# EAGLE design probebase (EAGLE 9.6.2)
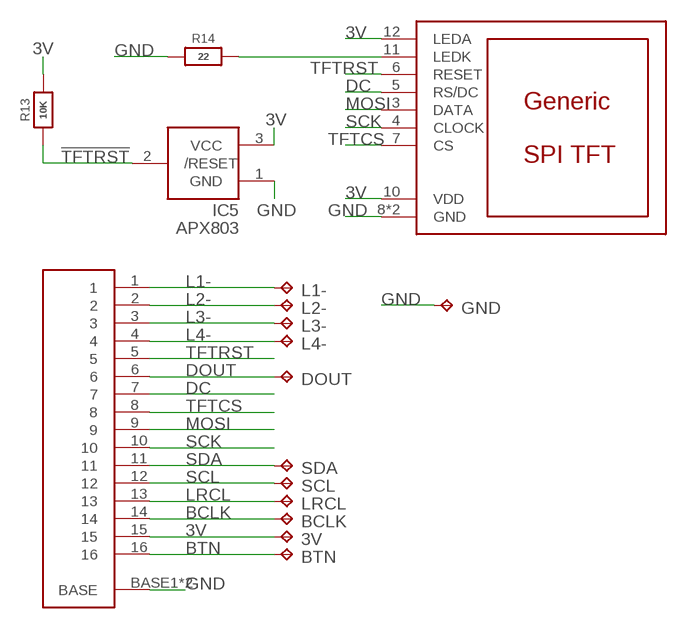
[diagram p0: schematic, sheet 1]

## Parts
3V  TPTP14R  [TP14R]
BCLK  TPTP14R  [TP14R]
BTN  TPTP14R  [TP14R]
DOUT  TPTP14R  [TP14R]
GND  TPTP14R  [TP14R]
IC5  APX803  AXP083-SAG  [SOT23]
L1-  TPTP14R  [TP14R]
L2-  TPTP14R  [TP14R]
L3-  TPTP14R  [TP14R]
L4-  TPTP14R  [TP14R]
LRCL  TPTP14R  [TP14R]
R13  10K  RESISTOR_0603_NOOUT  [0603-NO]
R14  22  RESISTOR_0603_NOOUT  [0603-NO]
SCL  TPTP14R  [TP14R]
SDA  TPTP14R  [TP14R]
U$3  16PINFFC  [16PINFFC]
U$4  TFT  [MICROBUILDER_TFT_1.14IN_240X135_WRAPUNDER]

## Nets
3V [battery]: 3V.TP IC5.3(VCC) R13.2 U$3.15 U$4.10(VDD) U$4.12(LEDA)
!TFTRST: IC5.2(/RESET) R13.1
BCLK: BCLK.TP U$3.14
BTN: BTN.TP U$3.16
DC: U$3.7 U$4.5(RS/DC)
DOUT: DOUT.TP U$3.6
GND [battery]: GND.TP IC5.1(GND) R14.1 U$3.BASE1(BASE) U$3.BASE2(BASE) U$4.8(GND) U$4.13(GND)
L1-: L1-.TP U$3.1
L2-: L2-.TP U$3.2
L3-: L3-.TP U$3.3
L4-: L4-.TP U$3.4
LRCL: LRCL.TP U$3.13
MOSI: U$3.9 U$4.3(DATA)
N$1: R14.2 U$4.11(LEDK)
SCK: U$3.10 U$4.4(CLOCK)
SCL: SCL.TP U$3.12
SDA: SDA.TP U$3.11
TFTCS: U$3.8 U$4.7(CS)
TFTRST: U$3.5 U$4.6(RESET)

## Library data of the parts
3V BCLK BTN DOUT GND L1- L2- L3- L4- LRCL SCL SDA = testpad:TP: Test pad
IC5 = adafruit:AXP083
R13 R14 = microbuilder:RESISTOR: Resistors For new designs, use the packages preceded by an '_' character since they are more reliable: The following footprints should be used on most boards: _0402 - Standard footprint for regular board layouts _0603 - Standard footprint for regular board layouts _0805 - Standard footprint for regular board layouts _1206 - Standard footprint for regular board layouts For extremely tight-pitch boards where space is at a premium, the following 'micro-pitch' footprints can be used (smaller pads, no silkscreen outline, etc.): _0402MP - Micro-pitch footprint for very dense/compact boards _0603MP - Micro-pitch footprint for very dense/compact boards _0805MP - Micro-pitch footprint for very dense/compact boards _1206MP - Micro-pitch footprint for very dense/compact boards
U$3 = general:16PINFFC
U$4 = general:TFT

## Net classes
0 default: width 0.152 mm, clearance 0.152 mm
1 battery: width 0.254 mm, clearance 0.152 mm

## Board
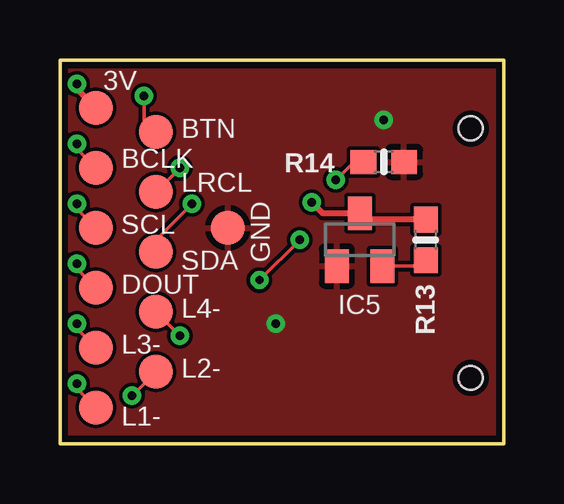
[diagram p1: board, top side]
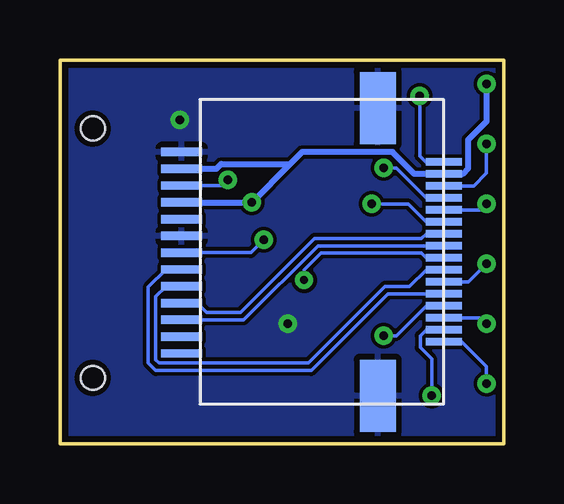
[diagram p2: board, bottom side, seen from below]

Size 18.5 x 16 mm. Coordinates in mm from the lower left corner, seen from the top.
Outline: 0,0 0,16 18.5,16 18.5,0 0,0
Copper layers (1*16): Top 0.035mm / dielectric 1.5mm / Bottom 0.035mm
Design rules "default *": minimum track width 6mil, minimum drill 0.35mm, track to track 6mil, track to pad 6mil, pad to pad 6mil, via to via 6mil, smd to smd 6mil, copper to edge 10mil, drill to drill 6mil, minimum pad ring 10mil, minimum via ring 8mil, stop-mask expansion 4mil, vias tented up to drill 0mil, thermal gap 10mil

### Footprints (pad centres in the part's own frame; a part is rotated, then mirrored left to right if it is on the bottom)
TP14R = smd 1.4 x 1.4: TP 0,0
SOT23 = smd 1 x 1.4: 1 -0.95,-1.1; 2 0.95,-1.1; 3 0,1.1
0603-NO = smd 1.075 x 1: 1 -0.85,0; 2 0.85,0
16PINFFC = smd 0.3 x 1.5: 1 -3.75,0; 2 -3.25,0; 3 -2.75,0; 4 -2.25,0; 5 -1.75,0; 6 -1.25,0; 7 -0.75,0; 8 -0.25,0; 9 0.25,0; 10 0.75,0; 11 1.25,0; 12 1.75,0; 13 2.25,0; 14 2.75,0; 15 3.25,0; 16 3.75,0 | smd 3 x 1.5: BASE1 -6,2.75; BASE2 6,2.75
MICROBUILDER_TFT_1.14IN_240X135_WRAPUNDER = smd 0.35 x 1.7: 1 4.24,2.07; 2 3.54,2.07; 3 2.84,2.07; 4 2.14,2.07; 5 1.44,2.07; 6 0.74,2.07; 7 0.04,2.07; 8 -0.66,2.07; 9 -1.36,2.07; 10 -2.06,2.07; 11 -2.76,2.07; 12 -3.46,2.07; 13 -4.16,2.07 | hole 1: -5.14,-1.63; 5.26,-1.63

### Placement (x,y rotation side)
3V  1.5,14 0 top
BCLK  1.5,11.5 0 top
BTN  4,13 0 top
DOUT  1.5,6.5 0 top
GND  7,9 0 top
IC5  12.5,8.5 0 top
L1-  1.5,1.5 0 top
L2-  4,3 0 top
L3-  1.5,4 0 top
L4-  4,5.5 0 top
LRCL  4,10.5 0 top
R13  15.25,8.5 90 top
R14  13.5,11.75 180 top
SCL  1.5,9 0 top
SDA  4,8 0 top
U$3  2.5,8 90 bottom
U$4  15.5,8 270 bottom

### Tracks (layer width: path | path; a pad name or v marks a point on that pad's centre or on a via)
3V  (via drill 0.35)
  Top 0.254: 3V.TP 0.71,14.79 v0.71,15 | R13.2 12.75,9.35 IC5.3 10.96,9.6 v10.5,10.06
  Bottom 0.254: v0.71,15 0.71,13.43 1.47,12.67 1.47,11.48 1.71,11.25 U$3.15 3.72,11.25 4.63,12.16 8.4,12.16 8.9,11.66 | U$4.10 v10.5,10.06 8.9,11.66 | U$4.12 11.97,11.46 11.77,11.66 8.9,11.66
!TFTRST
  Top 0.152: IC5.2 15,7.4 R13.1
BCLK  (via drill 0.35)
  Top 0.152: BCLK.TP 0.71,12.29 v0.71,12.5
  Bottom 0.152: v0.71,12.5 0.71,11.29 1.25,10.75 U$3.14
BTN  (via drill 0.35)
  Top 0.152: BTN.TP 3.5,13.5 v3.5,14.5
  Bottom 0.152: v3.5,14.5 3.5,12 3.25,11.75 U$3.16
DC
  Bottom 0.152: U$4.5 14.08,6.56 14.51,6.13 14.51,3.49 14.38,3.36 8.14,3.36 4.95,6.55 3.92,6.55 3.22,7.25 U$3.7
DOUT  (via drill 0.35)
  Top 0.152: DOUT.TP 0.71,7.29 v0.71,7.5
  Bottom 0.152: v0.71,7.5 1.46,6.75 U$3.6
GND  (via drill 0.35)
  other vias: 9,5 13.5,13.5
  pour Top: -1,-1 -1,17 21,17 21,-1
  pour Bottom: -2,-2 -2,18 22,18 22,-2
L1-  (via drill 0.35)
  Top 0.152: L1-.TP 0.71,2.29 v0.71,2.5
  Bottom 0.152: U$3.1 1.75,4.25 0.71,3.21 v0.71,2.5
L2-  (via drill 0.35)
  Top 0.152: L2-.TP v3,2
  Bottom 0.152: v3,2 3,3.53 3.48,4 3.48,4.5 3.22,4.75 U$3.2
L3-  (via drill 0.35)
  Top 0.152: L3-.TP 0.71,4.79 v0.71,5
  Bottom 0.152: v0.71,5 0.96,5.25 U$3.3
L4-  (via drill 0.35)
  Top 0.152: L4-.TP v5,4.5
  Bottom 0.152: v5,4.5 4.47,4.5 3.22,5.75 U$3.4
LRCL  (via drill 0.35)
  Top 0.152: LRCL.TP v5,11.5
  Bottom 0.152: v5,11.5 4.47,11.5 3.22,10.25 U$3.13
MOSI
  Bottom 0.152: U$3.9 7.75,8.25 10.84,5.16 U$4.3
N$1  (via drill 0.35)
  Top 0.152: R14.2 12.25,11.75 v11.5,11
  Bottom 0.152: v11.5,11 11.74,10.76 U$4.11
SCK
  Bottom 0.152: U$4.4 12.78,5.86 12.39,5.46 10.97,5.46 7.88,8.55 3.42,8.55 3.22,8.75 U$3.10
SCL  (via drill 0.35)
  Top 0.152: SCL.TP 0.71,9.79 v0.71,10
  Bottom 0.152: v0.71,10 0.96,9.75 U$3.12
SDA  (via drill 0.35)
  Top 0.152: SDA.TP 4,8.5 v5.5,10
  Bottom 0.152: v5.5,10 3.97,10 3.22,9.25 U$3.11
TFTCS  (via drill 0.35)
  Top 0.152: v8.32,6.82 v10,8.5
  Bottom 0.152: v10,8.5 10.54,7.96 U$4.7 | v8.32,6.82 8.32,7.25 7.62,7.95 3.42,7.95 3.22,7.75 U$3.8
TFTRST
  Bottom 0.152: U$3.5 4.82,6.25 8.02,3.05 14.5,3.05 14.81,3.36 14.81,6.53 14.08,7.26 U$4.6